# EAGLE schematic Pulse Earing (EAGLE 6.2)
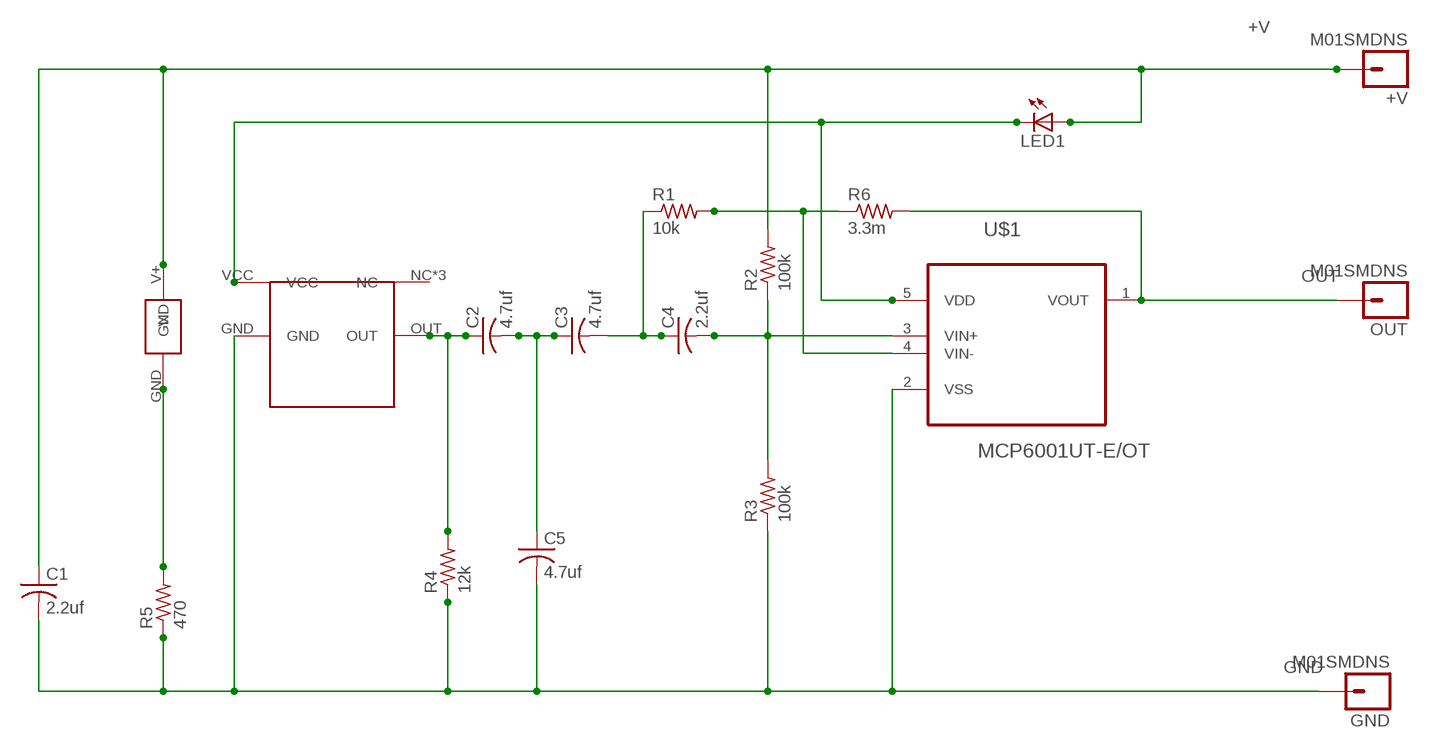
[diagram p0: schematic, sheet 1]

## Parts
+V  M01SMDNS  [1X01NS]
C1  2.2uf  C-USC0402  [C0402]
C2  4.7uf  C-USC0402  [C0402]
C3  4.7uf  C-USC0402  [C0402]
C4  2.2uf  C-USC0402  [C0402]
C5  4.7uf  C-USC0402  [C0402]
GND  M01SMDNS  [1X01NS]
LED1  LEDCHIP-LED0603  [CHIP-LED0603]
OUT  M01SMDNS  [1X01NS]
R1  10k  R-US_R0402  [R0402]
R2  100k  R-US_R0402  [R0402]
R3  100k  R-US_R0402  [R0402]
R4  12k  R-US_R0402  [R0402]
R5  470  R-US_R0402  [R0402]
R6  3.3m  R-US_R0402  [R0402]
U$1  MCP6001UT-E/OT  [SOT95P270X145-5N]
U$2  APDS9008  [APDS9008]
U$3  KBREVMTNLED  [KBREVMNTLED]

## Nets
+V: +V.1 C1.1 LED1.A R2.2 U$3.V+(V)
GND: C1.2 C5.2 GND.1 R3.1 R4.1 R5.1 U$1.2(VSS) U$2.GND
N$1: LED1.C U$1.5(VDD) U$2.VCC
N$2: R1.2 R6.1 U$1.4(VIN-)
N$3: C2.1 R4.2 U$2.OUT
N$4: C2.2 C3.1 C5.1
N$5: C3.2 C4.1 R1.1
N$6: C4.2 R2.1 R3.2 U$1.3(VIN+)
N$7: R5.2 U$3.GND
OUT: OUT.1 R6.2 U$1.1(VOUT)
Unconnected: U$2.NC U$2.NCC1(NC) U$2.NCC(NC)

## Library data of the parts
+V GND OUT = SparkFun:M01: Header 1 Standard 1-pin 0.1" header. Use with straight break away headers (SKU : PRT-00116), right angle break away headers (PRT-00553), swiss pins (PRT-00743), machine pins (PRT-00117), and female headers (PRT-00115).
C1-C5 = resistor:C-US: CAPACITOR, American symbol
LED1 = led:LED: LED OSRAM: - CHIPLED LG R971, LG N971, LY N971, LG Q971, LY Q971, LO R971, LY R971 LH N974, LH R974 LS Q976, LO Q976, LY Q976 LO Q996 - Hyper CHIPLED LW Q18S LB Q993, LB Q99A, LB R99A - SideLED LS A670, LO A670, LY A670, LG A670, LP A670 LB A673, LV A673, LT A673, LW A673 LH A674 LY A675 LS A676, LA A676, LO A676, LY A676, LW A676 LS A679, LY A679, LG A679 - Hyper Micro SIDELED® LS Y876, LA Y876, LO Y876, LY Y876 LT Y87S - SmartLED LW L88C, LW L88S LB L89C, LB L89S, LG L890 LS L89K, LO L89K, LY L89K LS L896, LA L896, LO L896, LY L896 - TOPLED LS T670, LO T670, LY T670, LG T670, LP T670 LSG T670, LSP T670, LSY T670, LOP T670, LYG T670 LG T671, LOG T671, LSG T671 LB T673, LV T673, LT T673, LW T673 LH T674 LS T676, LA T676, LO T676, LY T676, LB T676, LH T676, LSB T676, LW T676 LB T67C, LV T67C, LT T67C, LS T67K, LO T67K, LY T67K, LW E67C LS E67B, LA E67B, LO E67B, LY E67B, LB E67C, LV E67C, LT E67C LW T67C LS T679, LY T679, LG T679 LS T770, LO T770, LY T770, LG T770, LP T770 LB T773, LV T773, LT T773, LW T773 LH T774 LS E675, LA E675, LY E675, LS T675 LS T776, LA T776, LO T776, LY T776, LB T776 LHGB T686 LT T68C, LB T68C - Hyper Mini TOPLED® LB M676 - Mini TOPLED Santana® LG M470 LS M47K, LO M47K, LY M47K Source: http://www.osram.convergy.de LUXEON: - LUMILED® LXK2-PW12-R00, LXK2-PW12-S00, LXK2-PW14-U00, LXK2-PW14-V00 LXK2-PM12-R00, LXK2-PM12-S00, LXK2-PM14-U00 LXK2-PE12-Q00, LXK2-PE12-R00, LXK2-PE12-S00, LXK2-PE14-T00, LXK2-PE14-U00 LXK2-PB12-K00, LXK2-PB12-L00, LXK2-PB12-M00, LXK2-PB14-N00, LXK2-PB14-P00, LXK2-PB14-Q00 LXK2-PR12-L00, LXK2-PR12-M00, LXK2-PR14-Q00, LXK2-PR14-R00 LXK2-PD12-Q00, LXK2-PD12-R00, LXK2-PD12-S00 LXK2-PH12-R00, LXK2-PH12-S00 LXK2-PL12-P00, LXK2-PL12-Q00, LXK2-PL12-R00 Source: www.luxeon.com KINGBRIGHT: KA-3528ASYC Source: www.kingbright.com
R1-R6 = resistor:R-US_: RESISTOR, American symbol
U$1 = untitled:MCP6001UT-E/OT: 1 MHz, Low-Power Op Amp; MPN: MCP6001UT-E/OT; OC_FARNELL: 1840893; OC_NEWARK: 84R5183; PACKAGE: SOT23-5; SUPPLIER: Microchip
U$2 = untitled:APDS9008
U$3 = untitled:KBREVMTNLED